# Altium schematic sheet pca10056_sheet1_cover.SchDoc: PCA10056 - Cover
size A3; Organization: Nordic Semiconductor; DocumentNumber: 1; SheetNumber: 1; SheetTotal: 7; CompanyName: Nordic Semiconductor
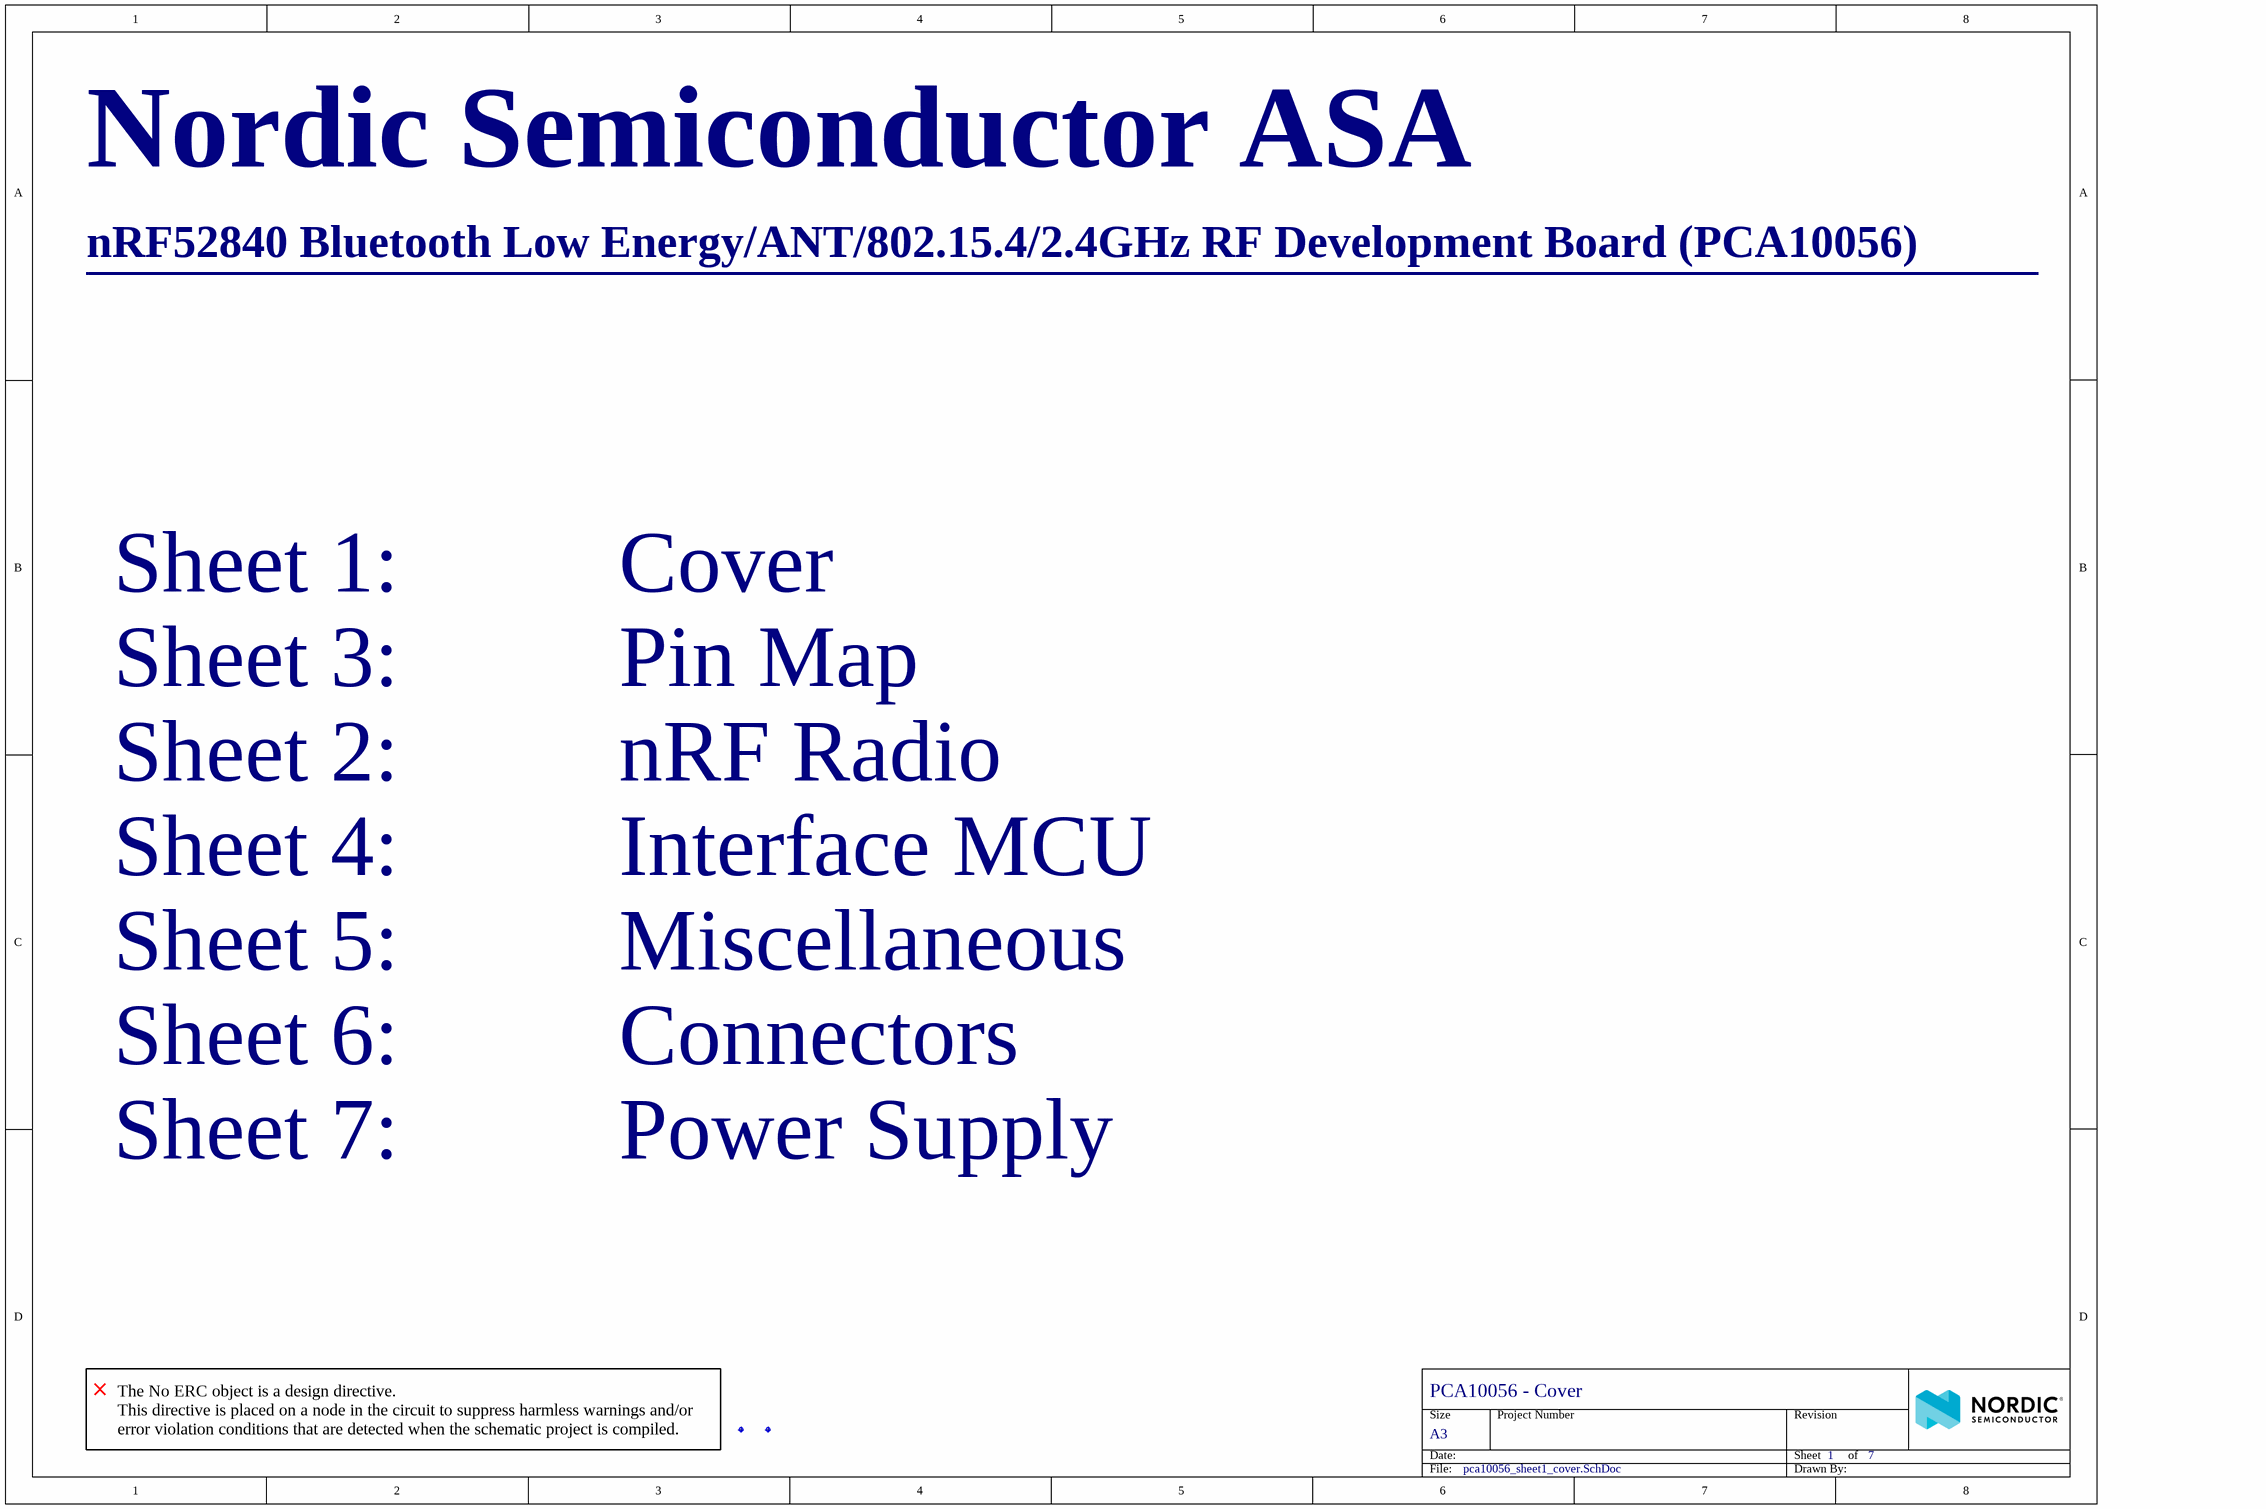
[diagram p0: pca10056_sheet1_cover.SchDoc]

## Parts
Fid1  Fiducial mark  [Fiducial]  (value not drawn)
Fid2  Fiducial mark  [Fiducial]  (value not drawn)

## Notes on the sheet
- Nordic Semiconductor ASA
- nRF52840 Bluetooth Low Energy/ANT/802.15.4/2.4GHz RF Development Board (PCA10056)
- ________________________________________________________________
- Sheet 1:          Cover
- Sheet 3:          Pin Map
- Sheet 2:          nRF Radio
- Sheet 4:          Interface MCU
- Sheet 5:          Miscellaneous
- Sheet 6:          Connectors
- Sheet 7:          Power Supply
- (near Fid1) The No ERC object is a design directive.
  This directive is placed on a node in the circuit to suppress harmless warnings and/or error violation conditions that are detected when the schematic project is compiled.
- Size
- Date:
- A3
- Project Number
- Sheet         of
- Revision
- File:
- Drawn By:

## Library data of the parts
Fid1 Fid2 = Fid-Mark: Artikkelnr Noca: N.A.; Part Number: Fid-Mark; Manufacturer: *; Manufacturer Part Number: *; Datasheet: *; LatestRevisionDate: 2009-12-12; Pin Count: 1; Publisher: Nordic Semiconductor; Published: 2009-12-12; Value: *; Note: *; Supplier: *; Supplier part number: *; 2nd source Supplier: *; 2nd source part number: *; Footprint Doc: Fiducial; Artikkelnr Simpro: N.A.